# EAGLE design JambossRev1 (EAGLE 6.3)
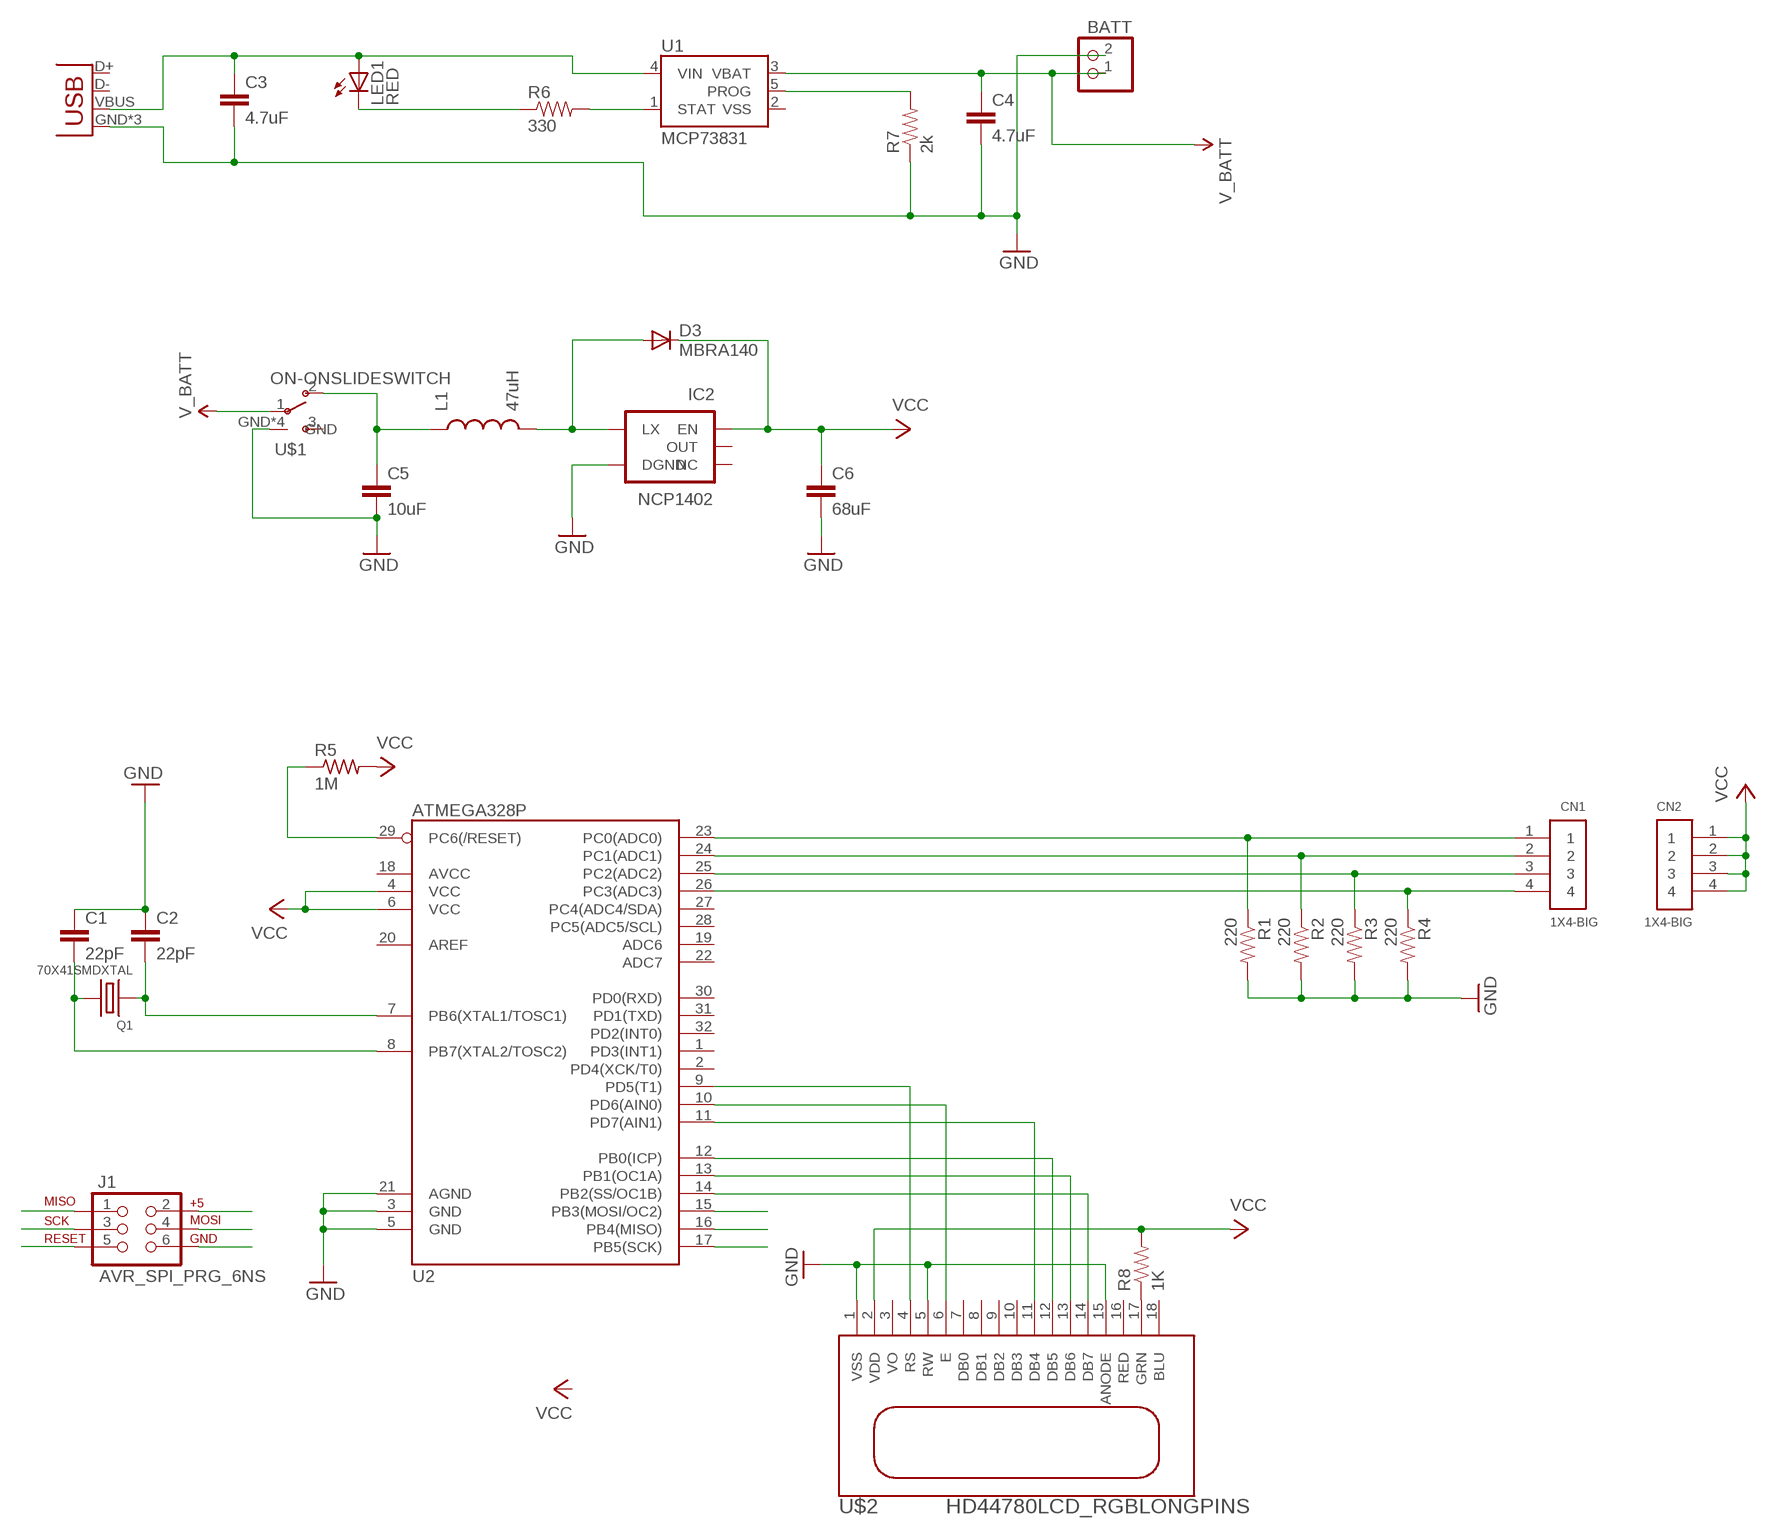
[diagram p0: schematic, sheet 1]

## Parts
BATT  JST_2PIN-THM-RA  [JST-PH-2-THM-RA]
C1  22pF  CAP0805  [0805]
C2  22pF  CAP0805  [0805]
C3  4.7uF  4.7UF-6.3V-10%(0603)0603  [0603-CAP]
C4  4.7uF  4.7UF-6.3V-10%(0603)0603  [0603-CAP]
C5  10uF  10UF-6.3V-20%(1206)  [1206]
C6  68uF  CAP0805  [0805]
CN1  1X4-BIG  [1X04-BIG]
CN2  1X4-BIG  [1X04-BIG]
D3  MBRA140  DIODESMA  [SMA-DIODE]
IC2  NCP1402  V_REG_NCP1400SOT23-5  [SOT23-5]
J1  AVR_SPI_PRG_6NS  [2X3-NS]
JP1  USB-MICROB  [USB-MICROB]
L1  47uH  INDUCTOR0805  [0805]
LED1  RED  LED-RED0603  [LED-0603]
Q1  70X41SMDXTAL  [XTAL-70X41]
R1  220  0.22OHM1/4W1%(0805)  [0805]
R2  220  0.22OHM1/4W1%(0805)  [0805]
R3  220  0.22OHM1/4W1%(0805)  [0805]
R4  220  0.22OHM1/4W1%(0805)  [0805]
R5  1M  R-US_R0603  [R0603]
R6  330  330OHM1/10W1%(0603)  [0603-RES]
R7  2k  2.0KOHM1/10W5%(0603)  [0603-RES]
R8  1K  RESISTOR0805-RES  [0805]
U1  MCP73831  [SOT23-5]
U2  ATMEGA328P  ATMEGA328_SMT  [TQFP32-08]
U$1  ON-ONSLIDESWITCH  [ONOFFSWITCHSMD]
U$2  HD44780LCD_RGBLONGPINS  [LCD1602-RGB]

## Nets
GND: BATT.2 C1.1 C2.1 C3.2 C4.2 C5.2 C6.2 IC2.4(DGND) J1.6 JP1.GND(DGND) JP1.MT1(DGND) JP1.MT2(DGND) R1.2 R2.2 R3.2 R4.2 R7.1 U2.3(GND) U2.5(GND) U2.21(AGND) U$1.GND U$1.GND2(GND) U$1.GND3(GND) U$1.GND4(GND) U$2.1(VSS) U$2.5(RW) U$2.15(ANODE)
GRN [5v]: R8.1 U$2.17(GRN)
MISO: J1.1 U2.16(PB4(MISO))
MOSI [data]: J1.4 U2.15(PB3(MOSI/OC2))
N$1: C2.2 Q1.P$1 U2.7(PB6(XTAL1/TOSC1))
N$2: C1.2 Q1.P$2 U2.8(PB7(XTAL2/TOSC2))
N$3: U2.14(PB2(SS/OC1B)) U$2.14(DB7)
N$4: U2.13(PB1(OC1A)) U$2.13(DB6)
N$5: U2.12(PB0(ICP)) U$2.12(DB5)
N$6: U2.11(PD7(AIN1)) U$2.11(DB4)
N$7: U2.10(PD6(AIN0)) U$2.6(E)
N$8: LED1.C R6.1
N$10: CN1.2 R2.1 U2.24(PC1(ADC1))
N$11: CN1.1 R1.1 U2.23(PC0(ADC0))
N$12: U2.9(PD5(T1)) U$2.4(RS)
N$13: CN1.3 R3.1 U2.25(PC2(ADC2))
N$14: CN1.4 R4.1 U2.26(PC3(ADC3))
N$15: R6.2 U1.1(STAT)
N$16: R7.2 U1.5(PROG)
N$17: C3.1 JP1.VBUS LED1.A U1.4(VIN)
N$21: D3.A IC2.5(LX) L1.2
N$22 [5v]: C5.1 L1.1 U$1.2
RESET: J1.5 R5.1 U2.29(PC6(/RESET))
SCK: J1.3 U2.17(PB5(SCK))
V_BATT [5v]: BATT.1 C4.1 U1.3(VBAT) U$1.1
VCC [5v]: C6.1 CN2.1 CN2.2 CN2.3 CN2.4 D3.C IC2.1(EN) J1.2 R5.2 R8.2 U2.4(VCC) U2.6(VCC) U$2.2(VDD)
Unconnected: IC2.2(OUT) IC2.3(NC) JP1.D+ JP1.D- U2.1(PD3(INT1)) U2.2(PD4(XCK/T0)) U2.18(AVCC) U2.19(ADC6) U2.20(AREF) U2.22(ADC7) U2.27(PC4(ADC4/SDA)) U2.28(PC5(ADC5/SCL)) U2.30(PD0(RXD)) U2.31(PD1(TXD)) U2.32(PD2(INT0)) U$1.3 U$2.3(VO) U$2.7(DB0) U$2.8(DB1) U$2.9(DB2) U$2.10(DB3) U$2.16(RED) U$2.18(BLU)

## Power pins joined to a net without a drawn wire
GND: U1.2(VSS)

## Library data of the parts
BATT = adafruit:JST_2PIN: JST 2-Pin Connectors of various flavors SMT-RA (S2B-PH-SM4) 4UConnector #17311 SMT (B2B-PH-SM4) THM-RA (S2B-PH) THM (B2B-PH)
C1 C2 = SparkFun-Capacitors:CAP: Capacitor Standard 0603 ceramic capacitor, and 0.1" leaded capacitor.
C3 C4 = SparkFun-Capacitors:4.7UF-6.3V-10%(0603): CAP-08280; PROD_ID: CAP-08280
C5 = SparkFun-Capacitors:10UF-6.3V-20%(1206): Ceramic CAP-10057; PROD_ID: CAP-10057
C6 = SparkFun-Passives:CAP: Capacitor Standard 0603 ceramic capacitor, and 0.1" leaded capacitor.
CN1 CN2 = adafruit:1X4: 4-pin connector
D3 = SparkFun-DiscreteSemi:DIODE: Diode These are standard reverse protection diodes and small signal diodes. SMA package can handle up to about 1A. SOD-323 can handle about 200mA. What the SOD-323 package when ordering, there are some mfgs out there that are 5-pin packages.
IC2 = SparkFun-PowerIC:V_REG_NCP1400: Switching step-up voltage regulator NCP1400 switiching regulator takes single cell AA and outputs 100mA at 3.3V or 5V with minimal number of external components.
J1 = SparkFun-Connectors:AVR_SPI_PRG_6: AVR ISP 6 Pin This is the reduced ISP connector for AVR programming. Common on Arduino. This footprint will take up less PCB space and can be used with a 10-pin to 6-pin adapter such as SKU: BOB-08508
JP1 = SparkFun-Connectors:USB: USB Connectors USB-B-PTH is fully proven SKU : PRT-00139/CONN-08278 USB-miniB is fully proven SKU : PRT-00587 USB-A-PCB is untested. USB-A-H is throughly reviewed, but untested. Spark Fun Electronics SKU : PRT-00437 USB-B-SMT is throughly reviewed, but untested. Needs silkscreen touching up. USB-A-S has not been used/tested USB-MB-H has not been used/tested USB-MICROB has been used. CONN-09505; PROD_ID: CONN-09505
L1 = SparkFun-Passives:INDUCTOR: Inductors Basic Inductor/Choke - 0603 and 1206. Footprints are not proven and vary greatly between part numbers. SRN6045- 33uH, 20% 1.4A SDR0403-560KL - 56uH, 10%, 500mA RMS/740mA peak
LED1 = SparkFun-LED:LED-RED: Assorted Red LEDs LilyPad 1206- DIO-09912 1206- DIO-00809 0603- DIO-00819; PROD_ID: DIO-00819
Q1 = iconcustom:70X41SMDXTAL: HTML Online Editor Sample SMD Crystal from ESC 7.0mm x 4.10mm Digikey part XC1776CT-ND Datasheet: http://www.ecsxtal.com/store/pdf/CSM-3X.pdf; VALUE: 16MHz
R1-R4 = SparkFun-Resistors:0.22OHM1/4W1%(0805): RES-09883; PROD_ID: RES-09883; VALUE: 0.22
R5 = adafruit:R-US_: RESISTOR, American symbol
R6 = SparkFun-Resistors:330OHM1/10W1%(0603): RES-00818; PROD_ID: RES-00818
R7 = SparkFun-Resistors:2.0KOHM1/10W5%(0603): RES-08296; PROD_ID: RES-08296; VALUE: 2.0k
R8 = SparkFun-Resistors:RESISTOR: Resistor Basic schematic elements and footprints for 0603, 1206, and PTH resistors.
U1 = SparkFun-PowerIC:MCP73831: Miniature single cell, fully integrated Li-Ion, Li-polymer charge management controller http://ww1.microchip.com/downloads/en/DeviceDoc/21984a.pdf IC-09995; PROD_ID: IC-09995
U2 = SparkFun-DigitalIC:ATMEGA328_SMT: 32-Pin Atmega328 part Commonly used on Arduino compatible boards Available in QFP and QFN packages TQFP is IC-09069 QFN is non-stock; PROD_ID: IC-09069
U$1 = iconcustom:ON-ONSLIDESWITCH: Digikey # 563-1102-1-ND SMD On-On switch, low profile, right angle.
U$2 = adafruit:HD44780LCD_RGB

## Net classes
1 5v: width 0.508 mm, clearance 0.381 mm

## Board
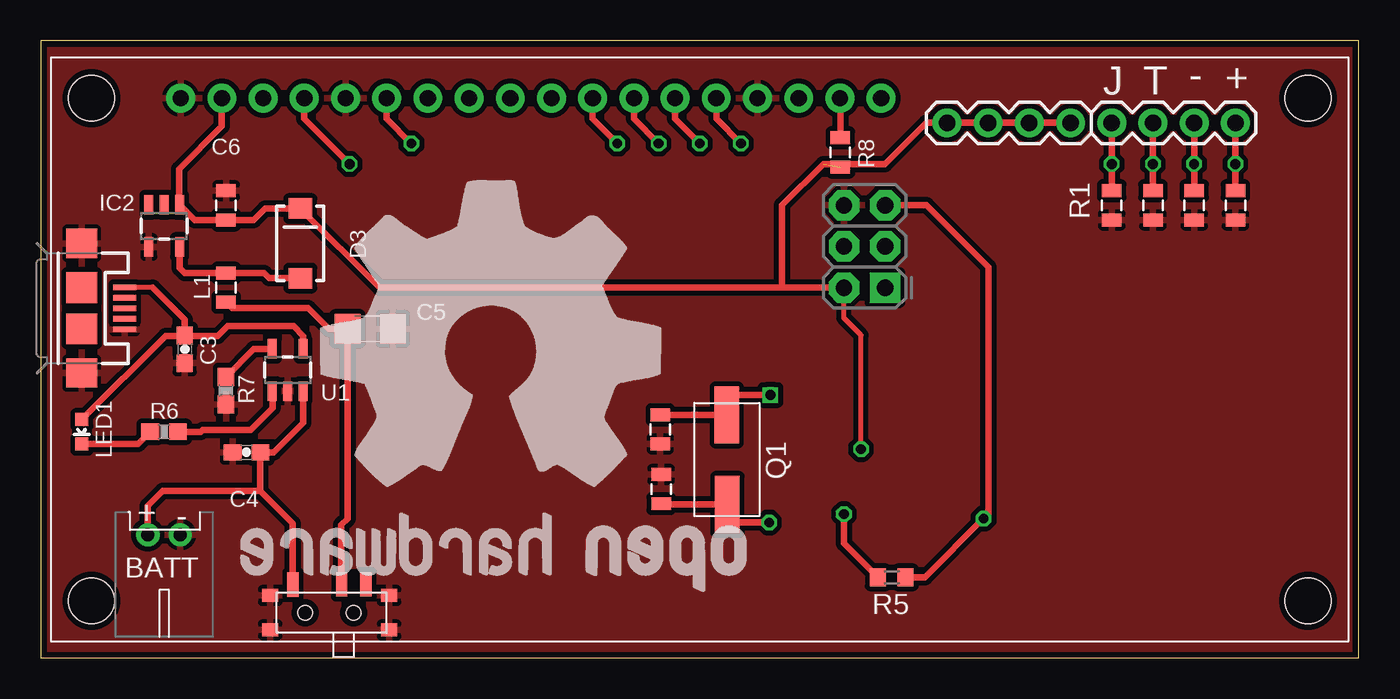
[diagram p1: board, top side]
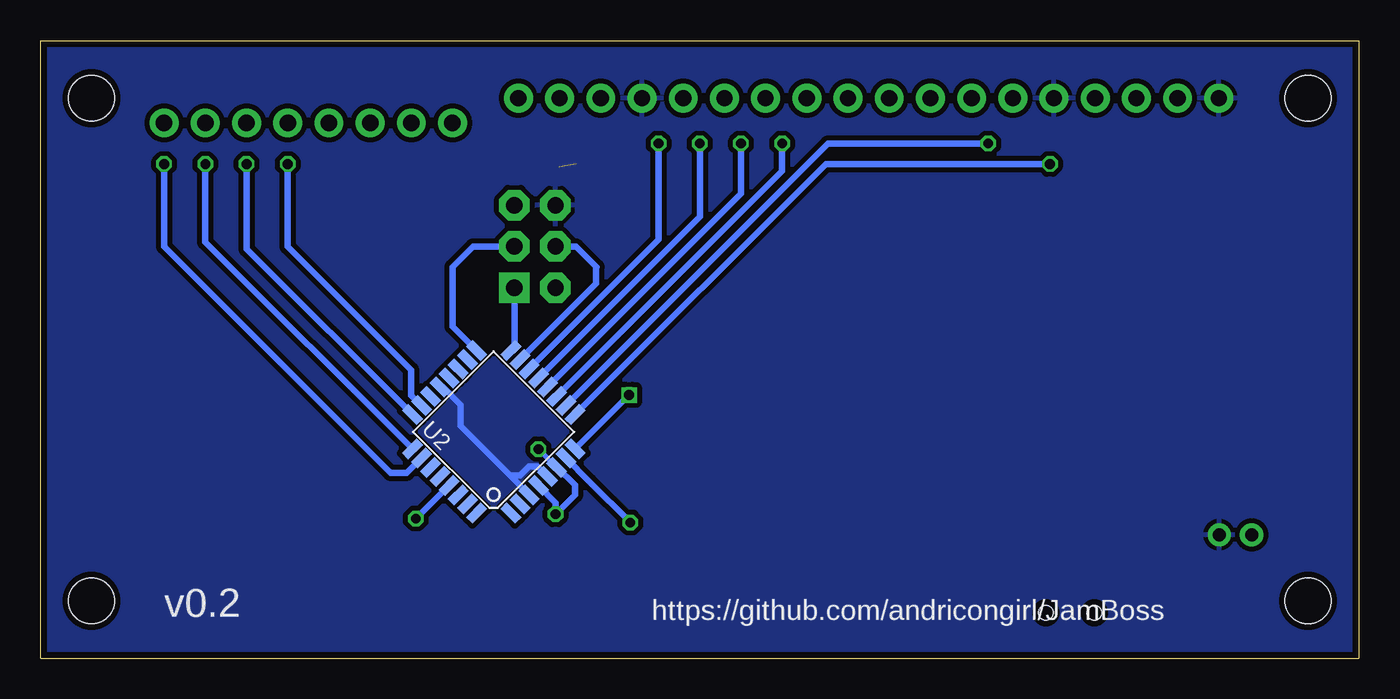
[diagram p2: board, bottom side, seen from below]

Size 81.28 x 38.1 mm. Coordinates in mm from the lower left corner, seen from the top.
Outline: 81.28,0 81.28,38.1 0,38.1 0,0 81.28,0
Copper layers (1*16): Top 0.0356mm / dielectric 1.5011mm / Bottom 0.0356mm
Design rules "LaenPCBOrder": minimum track width 6mil, minimum drill 13mil, track to track 6mil, track to pad 6mil, pad to pad 6mil, via to via 6mil, smd to smd 6mil, copper to edge 15mil, drill to drill 6mil, minimum pad ring 7mil, minimum via ring 7mil, stop-mask expansion 3mil, vias tented up to drill 0mil, thermal gap 10mil

### Footprints (pad centres in the part's own frame; a part is rotated, then mirrored left to right if it is on the bottom)
JST-PH-2-THM-RA = drill 0.8 pad 1.422: 1 1,0; 2 -1,0
0805 = smd 0.8 x 1.2: 1 -0.9,0; 2 0.9,0
0603-CAP = smd 1.1 x 1: 1 -0.85,0; 2 0.85,0
1206 = smd 1.6 x 1.8: 1 -1.4,0; 2 1.4,0
1X04-BIG = drill 1.016 pad 1.778: 1 0,0; 2 2.54,0; 3 5.08,0; 4 7.62,0
SMA-DIODE = smd 1.27 x 1.47: A -2.15,0; C 2.15,0
SOT23-5 = smd 0.55 x 1.2: 1 -0.95,-1.3; 2 0,-1.3; 3 0.95,-1.3; 4 0.95,1.3; 5 -0.95,1.3
2X3-NS = drill 1.016 pad 1.88 square: 1 -2.54,-1.27 | drill 1.016 pad 1.88 octagon: 2 -2.54,1.27; 3 0,-1.27; 4 0,1.27; 5 2.54,-1.27; 6 2.54,1.27
USB-MICROB = smd 0.35 x 1.4: D+ 0,2.65; D- -0.65,2.65; GND 1.3,2.65; ID 0.65,2.65; VBUS -1.3,2.65 | smd 1.8 x 1.9: MT1 -4,0; MT2 4,0 | smd 1.9 x 1.9: P$1 -1.27,0; P$2 1.27,0
LED-0603 = smd 0.8 x 0.8: A 0,-0.75; C 0,0.75
XTAL-70X41 = smd 3.5 x 1.5: P$1 2.766,0.033; P$2 -2.749,0
R0603 = smd 1 x 1.1: 1 -0.85,0; 2 0.85,0
0603-RES = smd 1.1 x 1: 1 -0.85,0; 2 0.85,0
TQFP32-08 = smd 1.27 x 0.559: 1 -4.293,2.8; 2 -4.293,2; 3 -4.293,1.2; 4 -4.293,0.4; 5 -4.293,-0.4; 6 -4.293,-1.2; 7 -4.293,-2; 8 -4.293,-2.8; 17 4.293,-2.8; 18 4.293,-2; 19 4.293,-1.2; 20 4.293,-0.4; 21 4.293,0.4; 22 4.293,1.2; 23 4.293,2; 24 4.293,2.8 | smd 0.559 x 1.27: 9 -2.8,-4.293; 10 -2,-4.293; 11 -1.2,-4.293; 12 -0.4,-4.293; 13 0.4,-4.293; 14 1.2,-4.293; 15 2,-4.293; 16 2.8,-4.293; 25 2.8,4.293; 26 2,4.293; 27 1.2,4.293; 28 0.4,4.293; 29 -0.4,4.293; 30 -1.2,4.293; 31 -2,4.293; 32 -2.8,4.293
ONOFFSWITCHSMD = smd 0.7 x 1.5: 1 -2.25,1.744; 2 0.751,1.749; 3 2.254,1.748 | smd 1 x 0.8: GND -3.653,1.066; GND2 -3.655,-1.053; GND3 3.678,1.07; GND4 3.678,-1.057 | hole 0.9: -1.5,0; 1.5,0
LCD1602-RGB = drill 1 pad 1.778: 1 -32,15.5; 2 -29.46,15.5; 3 -26.92,15.5; 4 -24.38,15.5; 5 -21.84,15.5; 6 -19.3,15.5; 7 -16.76,15.5; 8 -14.22,15.5; 9 -11.68,15.5; 10 -9.14,15.5; 11 -6.6,15.5; 12 -4.06,15.5; 13 -1.52,15.5; 14 1.02,15.5; 15 3.56,15.5; 16 6.1,15.5; 17 8.64,15.5; 18 11.18,15.5 | hole 2.8: -37.5,-15.5; -37.5,15.5; 37.5,15.5; 37.5,-15.5

### Placement (x,y rotation side)
BATT  7.62,7.62 180 top
C1  38.21,14.12 90 top
C2  38.27,10.44 270 top
C3  8.89,19.05 270 top
C4  12.7,12.7 180 top
C5  20.32,20.32 0 top
C6  11.43,27.94 90 top
CN1  66.04,33.02 0 top
CN2  55.88,33.02 0 top
D3  16.02,25.59 90 top
IC2  7.62,26.67 180 top
J1  50.8,25.4 90 top
JP1  2.54,21.59 270 top
L1  11.43,22.86 90 top
LED1  2.54,13.97 180 top
Q1  42.31,12.26 270 top
R1  66.04,27.94 270 top
R2  68.58,27.94 270 top
R3  71.12,27.94 270 top
R4  73.66,27.94 270 top
R5  52.48,4.99 180 top
R6  7.62,13.97 0 top
R7  11.43,16.51 90 top
R8  49.31,31.2 270 top
U1  15.24,17.78 0 top
U2  53.34,13.97 135 bottom
U$1  17.81,2.81 0 top
U$2  40.64,19.05 0 top
U$3  [OSH-LOGO-HUGE]  27.8,18.99 0 bottom

### Tracks (layer width: path | path; a pad name or v marks a point on that pad's centre or on a via)
GND
  Bottom 0.406: U2.3 52.35,11.28 | 52.35,11.28 55.39,14.33 55.39,15.64 56.48,16.72 U2.21 | U2.5 50.63,11.83 51.16,11.83 51.71,11.28 52.35,11.28
  pour Top (isolate 0.305): 0,38.1 81.28,38.1 81.28,0 0,0
  pour Bottom (isolate 0.305): 0,38.1 81.28,38.1 81.28,0 0,0
GRN
  Top 0.406: R8.1 49.31,34.52 U$2.17
MISO
  Bottom 0.406: J1.1 52.07,19.2 U2.16
MOSI
  Bottom 0.406: U2.15 47.03,23.12 47.03,24.09 46.99,24.13 48.26,25.4 J1.4
N$1  (via drill 0.6)
  Top 0.406: v44.92,8.37 42.34,8.37 Q1.P$1 38.31,9.49 C2.2
  Bottom 0.406: U2.7 47.46,10.92 v44.92,8.37
N$2  (via drill 0.6)
  Top 0.406: v45,16.27 v44.99,16.26 | v45,16.24 42.31,16.24 Q1.P$2 C1.2
  Bottom 0.406: U2.8 v45,16.24 v45,16.27
N$3  (via drill 0.6)
  Top 0.406: U$2.14 41.66,33.27 v43.18,31.75
  Bottom 0.406: v43.18,31.75 43.18,25.83 U2.14
N$4  (via drill 0.6)
  Top 0.406: U$2.13 39.12,33.27 v40.64,31.75
  Bottom 0.406: v40.64,31.75 40.64,27.24 U2.13
N$5  (via drill 0.6)
  Top 0.406: U$2.12 36.58,33.27 v38.1,31.75
  Bottom 0.406: v38.1,31.75 38.1,28.64 U2.12
N$6  (via drill 0.6)
  Top 0.406: U$2.11 34.04,33.27 v35.56,31.75
  Bottom 0.406: v35.56,31.75 35.56,30.05 U2.11
N$7  (via drill 0.6)
  Top 0.406: U$2.6 21.34,33.27 v22.86,31.75
  Bottom 0.406: v22.86,31.75 32.73,31.75 U2.10
N$8
  Top 0.406: LED1.C 6.02,13.22 R6.1
N$10  (via drill 0.6)
  Top 0.406: CN1.2 v68.58,30.48 R2.1
  Bottom 0.406: U2.24 68.58,25.25 v68.58,30.48
N$11  (via drill 0.6)
  Top 0.406: CN1.1 v66.04,30.48 R1.1
  Bottom 0.406: U2.23 58.42,16.22 58.42,17.78 66.04,25.4 v66.04,30.48
N$12  (via drill 0.6)
  Top 0.406: U$2.4 16.26,33.27 v19.05,30.48
  Bottom 0.406: v19.05,30.48 32.87,30.48 U2.9
N$13  (via drill 0.6)
  Top 0.406: CN1.3 v71.12,30.48 R3.1
  Bottom 0.406: U2.25 71.12,25.68 v71.12,30.48
N$14  (via drill 0.6)
  Top 0.406: CN1.4 v73.66,30.48 R4.1
  Bottom 0.406: U2.26 58.71,11.43 59.69,11.43 73.66,25.4 v73.66,30.48
N$15
  Top 0.406: R6.2 9.87,13.97 10,14.1 12.96,14.1 14.3,15.45 14.3,16.46 U1.1
N$16
  Top 0.406: U1.5 13.15,19.08 R7.2
N$17
  Top 0.305: 6.9,22.88 JP1.VBUS
  Top 0.406: U1.4 16.19,19.89 15.6,20.48 11.53,20.48 10.93,19.89 8.9,19.89 | 8.9,19.89 C3.1 8.89,20.89 6.9,22.88 | 8.9,19.89 7.71,19.89 LED1.A
N$21
  Top 0.406: D3.A 14.09,23.44 13.78,23.76 L1.2 8.88,23.76 8.57,24.08 IC2.5
N$22
  Top 0.406: L1.1 11.8,21.59 16.51,21.59 17.78,20.32 C5.1 18.92,8.61 18.53,8.22 18.53,5.56 U$1.2
RESET  (via drill 0.6)
  Top 0.406: R5.1 54.52,5 v58.14,8.62 58.42,8.89 58.42,24.13 54.61,27.94 J1.5
  Bottom 0.406: v58.14,8.62 58.13,8.62 U2.29
SCK
  Bottom 0.406: J1.3 54.61,25.4 55.88,24.13 55.88,20.47 U2.17
V_BATT
  Top 0.406: U1.3 16.19,14.52 14.37,12.7 C4.1 13.55,10.43 | 13.55,10.43 13.55,10.31 15.54,8.33 15.54,5.56 U$1.1 | BATT.1 6.62,9.39 7.54,10.31 13.44,10.31 13.55,10.43
VCC  (via drill 0.6)  (1 unrouted)
  Top 0.305: v50.58,12.9 50.58,19.92 49.52,20.99 49.52,22.85 J1.2
  Top 0.406: J1.2 45.72,22.86 | 45.72,22.86 20.9,22.86 D3.C 13.85,27.74 13.15,27.04 C6.1 9.5,27.04 IC2.1 8.54,28 8.54,30.16 11.18,32.8 U$2.2 | CN2.4 CN2.3 CN2.2 CN2.1 54.61,33.02 52.07,30.48 48.26,30.48 45.72,27.94 45.72,22.86 | v49.53,8.89 49.53,7.09 R5.2
  Bottom 0.305: U2.6 v50.58,12.9
  Bottom 0.406: U2.4 49.53,9.59 v49.53,8.89 48.34,10.08 48.34,10.69 49.42,11.78 U2.6

### Text on the board
tPlace: J | T | - | +
bPlace: v0.2 | https://github.com/andricongirl/JamBoss